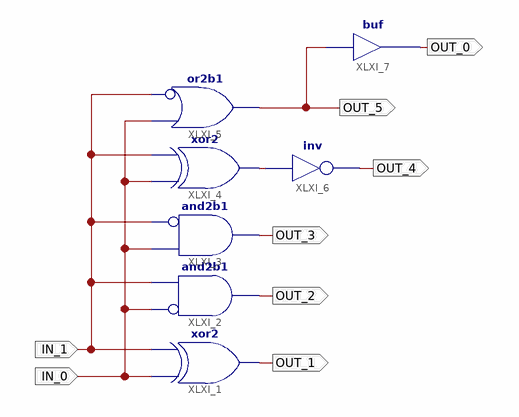
[diagram p0: schematic sheet 1]
// Xilinx ISE schematic My2To6Decoder.sch (spartan3a) as structural Verilog: 7 symbols, 8 ports
module My2To6Decoder (
  input  IN_0,
  input  IN_1,
  output OUT_1,
  output OUT_2,
  output OUT_3,
  output OUT_5,
  output OUT_4,
  output OUT_0
);

  wire XLXN_9;

  xor XLXI_1 (OUT_1, IN_0, IN_1);
  and XLXI_2 (OUT_2, ~IN_0, IN_1);  // and2b1
  and XLXI_3 (OUT_3, ~IN_1, IN_0);  // and2b1
  xor XLXI_4 (XLXN_9, IN_0, IN_1);
  or XLXI_5 (OUT_5, ~IN_1, IN_0);  // or2b1
  not XLXI_6 (OUT_4, XLXN_9);
  buf XLXI_7 (OUT_0, OUT_5);
endmodule
